# EasyEDA Pro project 单相电表PCB.epro

# Schematic Schematic1
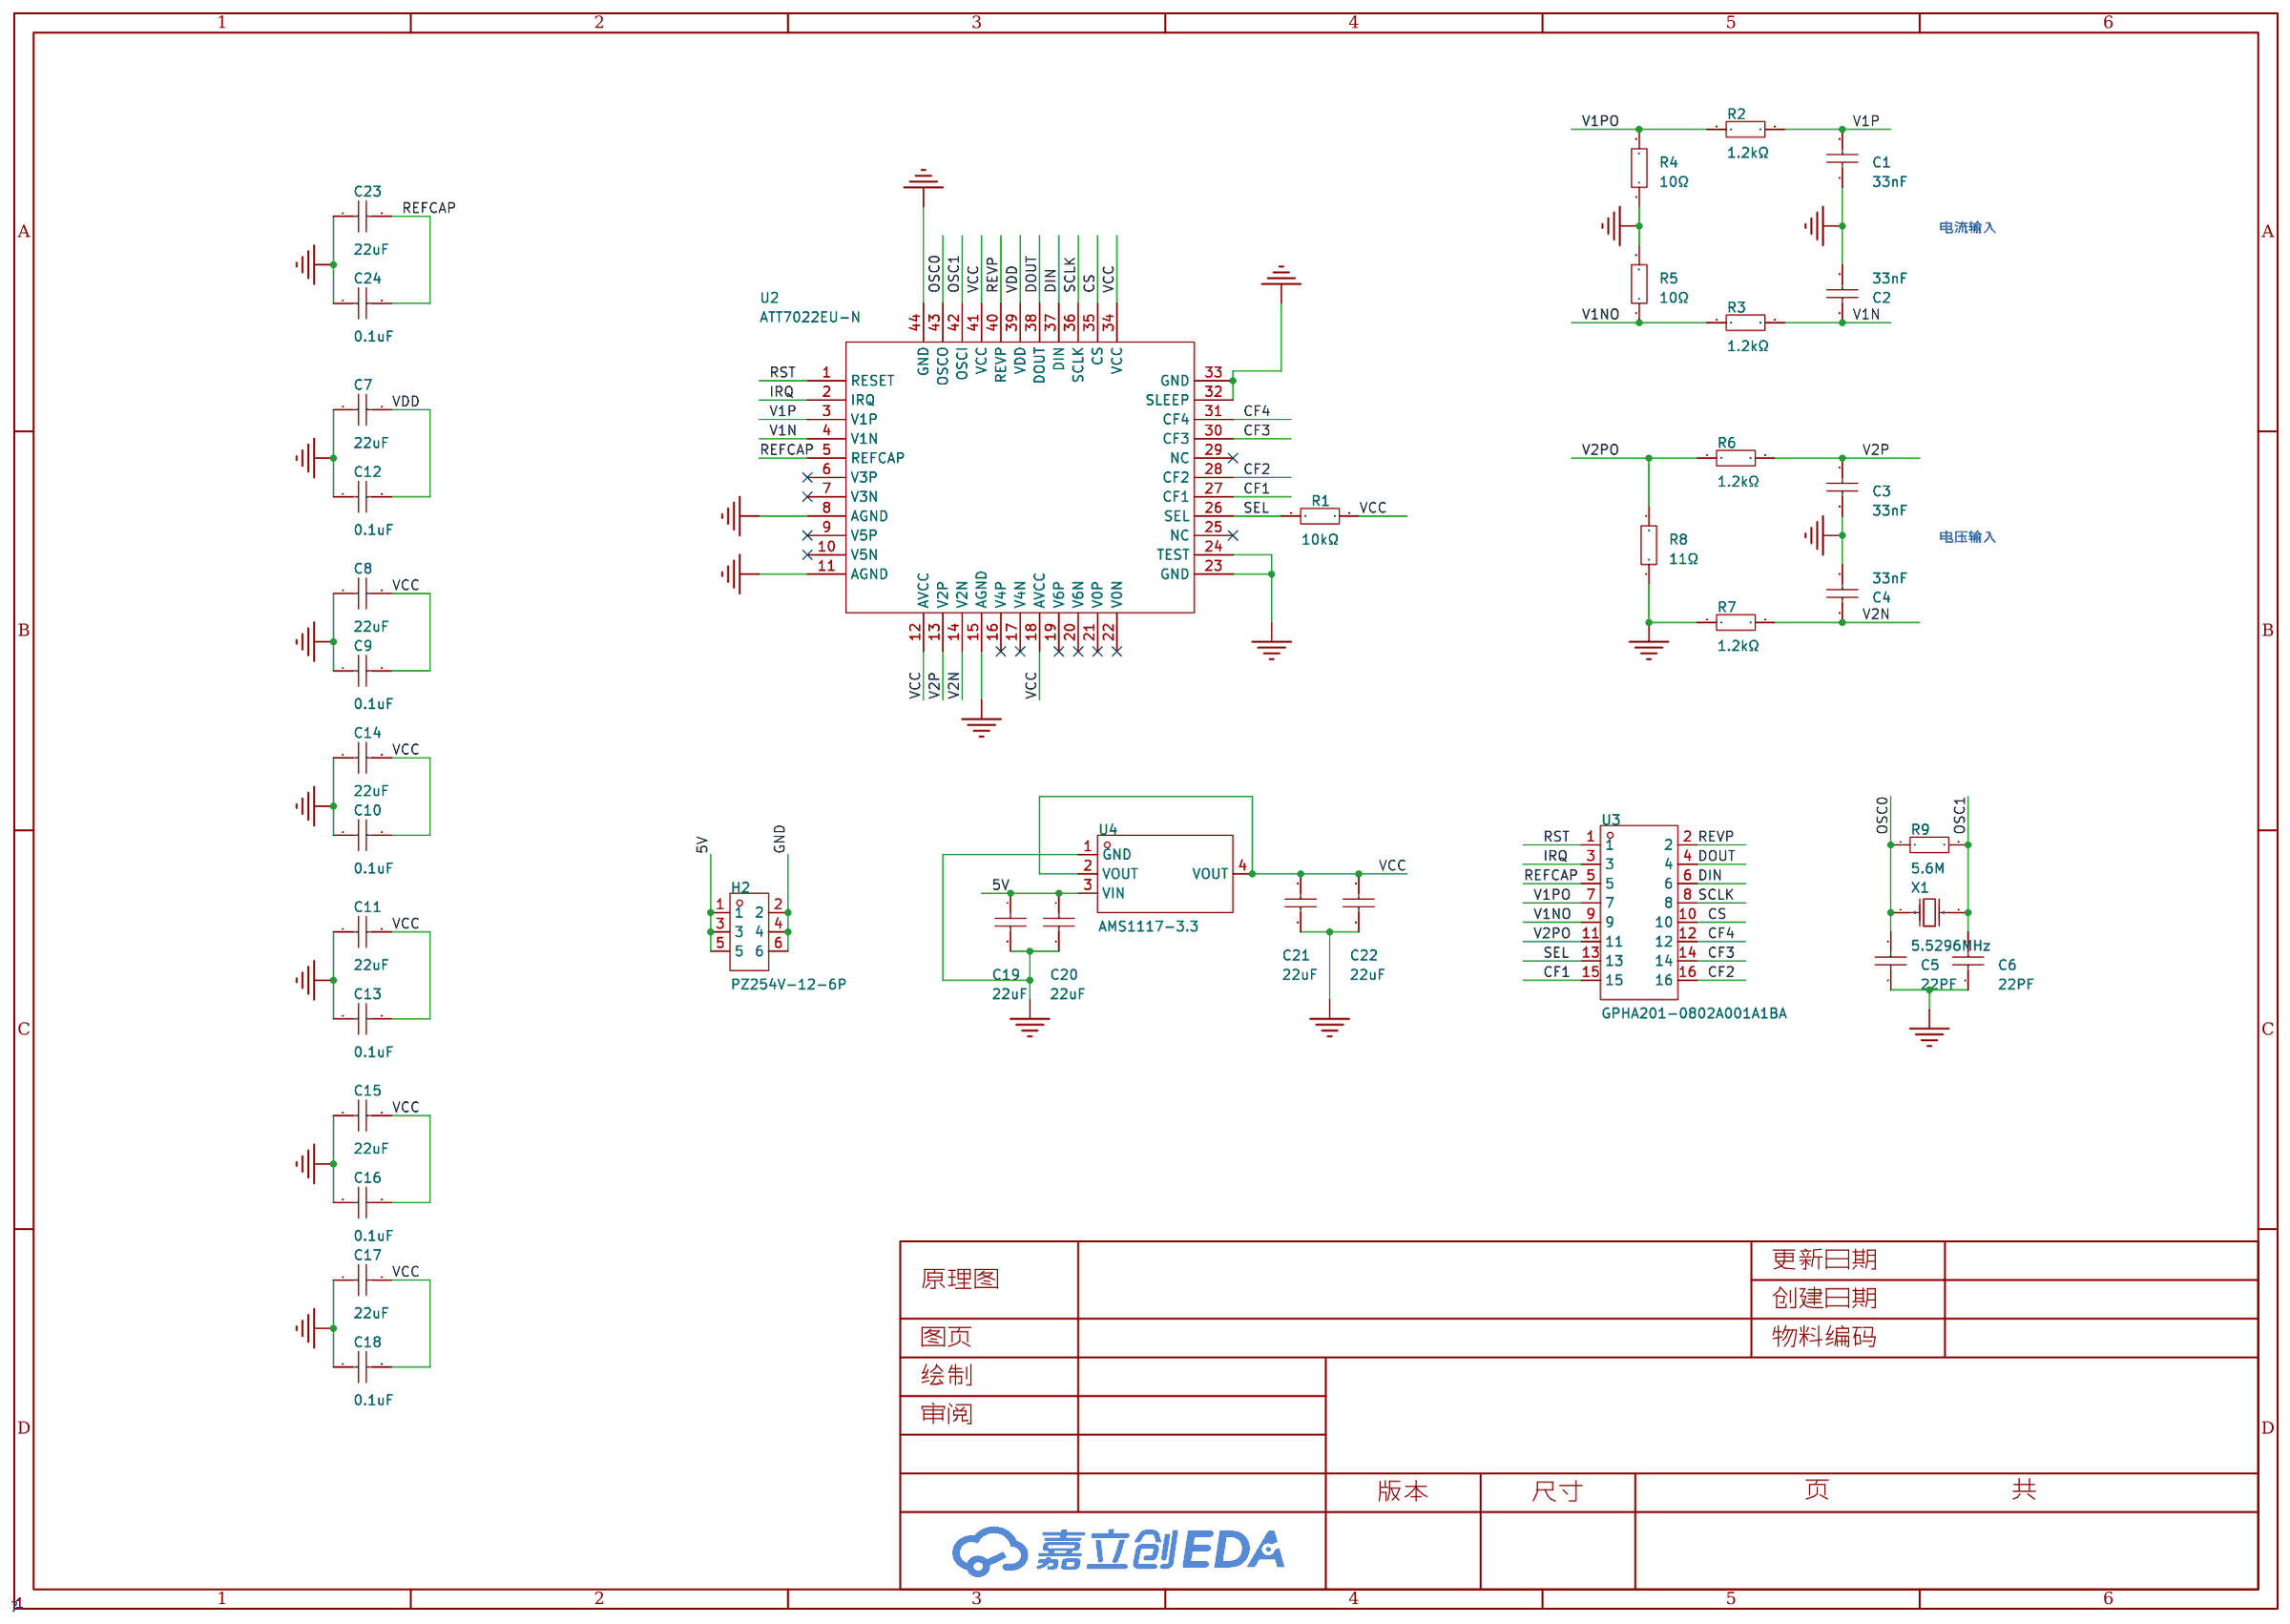
[diagram p0: schematic sheet]

## Parts
C1  33nF  [C0805]
C2  33nF  [C0805]
C3  33nF  [C0805]
C4  33nF  [C0805]
C5  22PF  [C0805]
C6  22PF  [C0805]
C7  22uF  [C0805]
C8  22uF  [C0805]
C9  0.1uF  [C0805]
C10  0.1uF  [C0805]
C11  22uF  [C0805]
C12  0.1uF  [C0805]
C13  0.1uF  [C0805]
C14  22uF  [C0805]
C15  22uF  [C0805]
C16  0.1uF  [C0805]
C17  22uF  [C0805]
C18  0.1uF  [C0805]
C19  22uF  [C0805]
C20  22uF  [C0805]
C21  22uF  [C0805]
C22  22uF  [C0805]
C23  22uF  [C0805]
C24  0.1uF  [C0805]
H2  PZ254V-12-6P  [HDR-TH_6P-P2.54-V-M-R2-C3-S2.54]
R1  10kΩ  [R0805]
R2  1.2kΩ  [R0805]
R3  1.2kΩ  [R0805]
R4  10Ω  [R0805]
R5  10Ω  [R0805]
R6  1.2kΩ  [R0805]
R7  1.2kΩ  [R0805]
R8  11Ω  [R0805]
R9  5.6M  [R0805]
U2  ATT7022EU-N  [LQFP-44_L10.0-W10.0-P0.80-LS12.0-BL]
U3  GPHA201-0802A001A1BA  [HDR-TH_16P-P2.54-V-M-R2-C8-S2.54]
U4  AMS1117-3.3  [SOT-223-3_L6.5-W3.4-P2.30-LS7.0-BR]
X1  5.5296MHz  [HC-49S_L11.4-W4.8-LS12.7]

## Library data of the parts
C1-C24 = CC0805KRX7R9BB104: 容值:100nF;精度:±10%;额定电压:50V;材质(温度系数):X7R;; LCSC Part Name: 100nF ±10% 50V; Supplier Part: C49678; Manufacturer: YAGEO(国巨); Supplier Footprint: 0805; JLCPCB Part Class: 基础库; Datasheet: https://atta.szlcsc.com/upload/public/pdf/source/20180224/C181747_15194369449651363981.pdf; Supplier: LCSC; Tolerance: ±10%; Voltage Rated: 50V; Temperature Coefficient: X7R
H2 = PZ254V-12-6P: 插针结构:2x3P;间距:2.54mm;行距:2.54mm;圆针/方针:方针;安装类型:直插;排数:双排;总PIN位数:6P;额定电流:-;额定电压:-;配合针长度:6mm;塑高:2.5mm;端接针长度:3mm;触头材质:黄铜;触头镀层:-;工作温度范围:-40℃~+105℃;颜色:黑色;; LCSC Part Name: 间距:2.54mm 2x3P 直插 方针; Supplier Part: C492420; Manufacturer: XFCN(兴飞); Supplier Footprint: 插件,P=2.54mm; JLCPCB Part Class: 扩展库; Datasheet: https://atta.szlcsc.com/upload/public/pdf/source/20200309/C492420_BAECB307B001054C09D200388220EAE6.pdf; Supplier: LCSC; Pin Structure: 2x3P; Pitch: 2.54mm; Row Spacing: 2.54mm; Circluar Pins/Square Pins: 方针; Mounting Type: 直插; Number of Rows: 双排; Number of Pins: 6P; Length of Mating Pin: 6mm; Insulation Height: 2.5mm; Length of End Connection Pin: 3mm; Contact Material: 黄铜; Operating Temperature Range: -40℃~+105℃; Color: 黑色
R1-R9 = 0805W8F1002T5E_C17414: 电阻类型:厚膜电阻;阻值:10kΩ;精度:±1%;功率:125mW;最大工作电压:150V;温度系数:±100ppm/℃;; LCSC Part Name: 10kΩ ±1% 125mW 厚膜电阻; Supplier Part: C17414; Manufacturer: UNI-ROYAL(厚声); Manufacturer Part: 0805W8F1002T5E; Supplier Footprint: 0805; JLCPCB Part Class: 基础库; Datasheet: https://atta.szlcsc.com/upload/public/pdf/source/20200306/C422600_1E6D84923E4A46A82E41ADD87F860B5C.pdf; Supplier: LCSC; Type: 厚膜电阻; Tolerance: ±1%; Power(Watts): 125mW; Overload Voltage (Max): 150V; Temperature Coefficient: ±100ppm/℃; Operating Temperature Range: -55℃~+155℃
U2 = ATT7022EU-N: Supplier Part: C81610; Manufacturer: 钜泉光电; Supplier Footprint: LQFP-44(10x10); JLCPCB Part Class: 扩展库; Datasheet: https://atta.szlcsc.com/upload/public/pdf/source/20170821/C126777_1503303399836901652.pdf; Supplier: LCSC
U3 = GPHA201-0802A001A1BA: 插针结构:2x8P;间距:2.54mm;行距:2.54mm;圆针/方针:方针;安装类型:直插;排数:双排;总PIN位数:16P;额定电流:3A;工作温度范围:-40℃~+105℃;; LCSC Part Name: 2x8P 间距:2.54mm 方针 直插; Supplier Part: C7434500; Manufacturer: GREENCONN(格康); Supplier Footprint: 插件,P=2.54mm; JLCPCB Part Class: 扩展库; Datasheet: https://atta.szlcsc.com/upload/public/pdf/source/20230629/613DF7C618537BFD465DA32CACFAE383.pdf; Supplier: LCSC; Pin Structure: 2x8P; Pitch: 2.54mm; Row Spacing: 2.54mm; Circluar Pins/Square Pins: 方针; Mounting Type: 直插; Number of Rows: 双排; Number of Pins: 16P; Current Rating (Max): 3A; Operating Temperature Range: -40℃~+105℃
U4 = AMS1117-3.3_C6186: 输出类型:固定;最大输入电压:-;输出电压:3.3V;最大输出电流:1A;电源纹波抑制比(PSRR):72dB@(120Hz);输出极性:正极;; LCSC Part Name: 输出3.3V 1A; Supplier Part: C6186; Manufacturer: AMS; Supplier Footprint: SOT-223; JLCPCB Part Class: 基础库; Datasheet: https://atta.szlcsc.com/upload/public/pdf/source/20180727/C6186_7A095716F0823C02F1997A905E26C086.pdf; Supplier: LCSC; Output Type: 固定; Output Voltage: 3.3V; MAX Output Current: 1A; Power Supply Rejection Ratio (PSRR): 72dB@(120Hz); Dropout Voltage: 1.3V@(800mA); Output Polarity: 正极; Number of Outputs: 1
X1 = H6OEL89CSC-SUGYLC-5.5296M: 晶振类型:贴片晶振;频率:5.5296MHz;常温频差:±20ppm;外接负载电容:20pF;频率稳定度(全温):±30ppm;; LCSC Part Name: 5.5296MHz ±20ppm 20pF; Supplier Part: C7471630; Manufacturer: YXC(扬兴晶振); Supplier Footprint: HC-49S-SMD; Datasheet: https://atta.szlcsc.com/upload/public/pdf/source/20240329/3EBF42EBCAB50CA65B6FA9D7CFA1955A.pdf; Supplier: LCSC; Crystal Type: 贴片晶振; Normal temperature Frequency Tolerance: ±20ppm; External load capacitor: 20pF; Frequency Stability(Full temperature range): ±30ppm; Operating Temperature: -20℃~+70℃

## Nets
5V: C19.1 C20.1 H2.1 H2.3 H2.5 U4.3(VIN)
GND: C1.1 C2.2 C3.1 C4.2 C5.1 C6.1 C7.2 C8.2 C9.2 C10.2 C11.2 C12.2 C13.2 C14.2 C15.2 C16.2 C17.2 C18.2 C19.2 C20.2 C21.2 C22.2 C23.2 C24.2 H2.2 H2.4 H2.6 R4.1 R5.2 R7.1 R8.1 U2.8(AGND) U2.11(AGND) U2.15(AGND) U2.23(GND) U2.24(TEST) U2.32(SLEEP) U2.33(GND) U2.44(GND) U4.1(GND)
V1N: C2.1 R3.2 U2.4(V1N)
V1NO: R3.1 R5.1 U3.9
V1P: C1.2 R2.2 U2.3(V1P)
V1PO: R2.1 R4.2 U3.7
V2N: C4.1 R7.2 U2.14(V2N)
V2P: C3.2 R6.2 U2.13(V2P)
V2PO: R6.1 R8.2 U3.11
VCC: C8.1 C9.1 C10.1 C11.1 C13.1 C14.1 C15.1 C16.1 C17.1 C18.1 C21.1 C22.1 R1.2 U2.12(AVCC) U2.18(AVCC) U2.34(VCC) U2.41(VCC) U4.2(VOUT) U4.4(VOUT)
VDD: C7.1 C12.1 U2.39(VDD)
CF1: U2.27(CF1) U3.15
CF2: U2.28(CF2) U3.16
CF3: U2.30(CF3) U3.14
CF4: U2.31(CF4) U3.12
CS: U2.35(CS) U3.10
DIN: U2.37(DIN) U3.6
DOUT: U2.38(DOUT) U3.4
IRQ: U2.2(IRQ) U3.3
OSC0: C5.2 R9.1 U2.43(OSCO) X1.1(OSC1)
OSC1: C6.2 R9.2 U2.42(OSCI) X1.2(OSC2)
REFCAP: C23.1 C24.1 U2.5(REFCAP) U3.5
REVP: U2.40(REVP) U3.2
RST: U2.1(RESET) U3.1
SCLK: U2.36(SCLK) U3.8
SEL: R1.1 U2.26(SEL) U3.13

Not connected (* = marked no-connect by the designer): U2 6(V3P)* 7(V3N)* 9(V5P)* 10(V5N)* 16(V4P)* 17(V4N)* 19(V6P)* 20(V6N)* 21(V0P)* 22(V0N)* 25(NC)* 29(NC)*

## Notes on the sheet
- 电流输入
- 电压输入

# Board PCB1
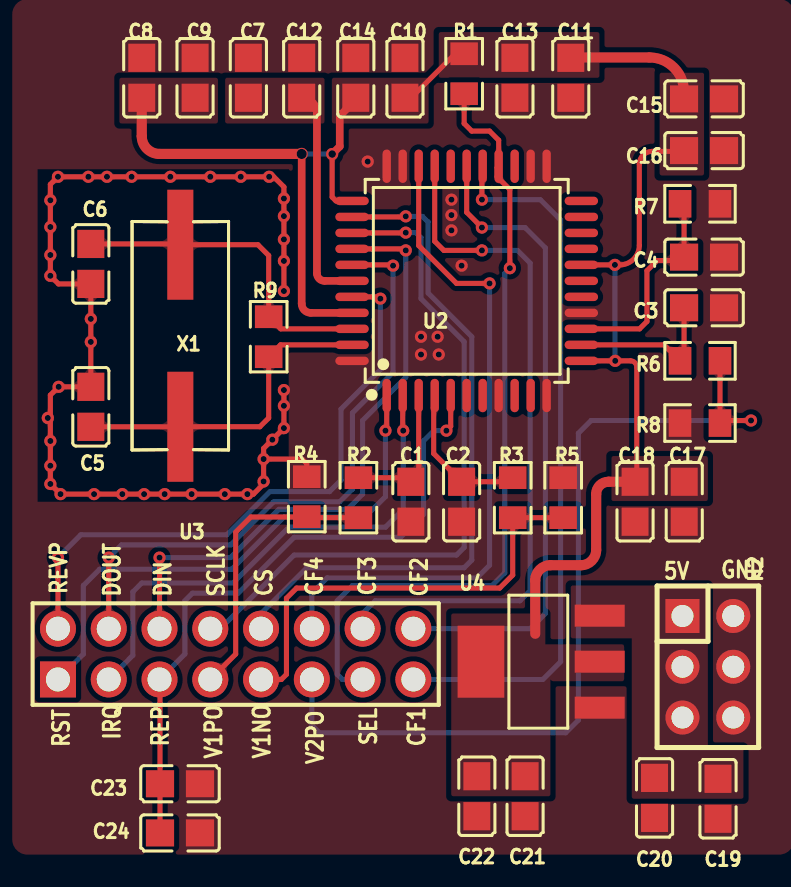
[diagram p1: board, top side]
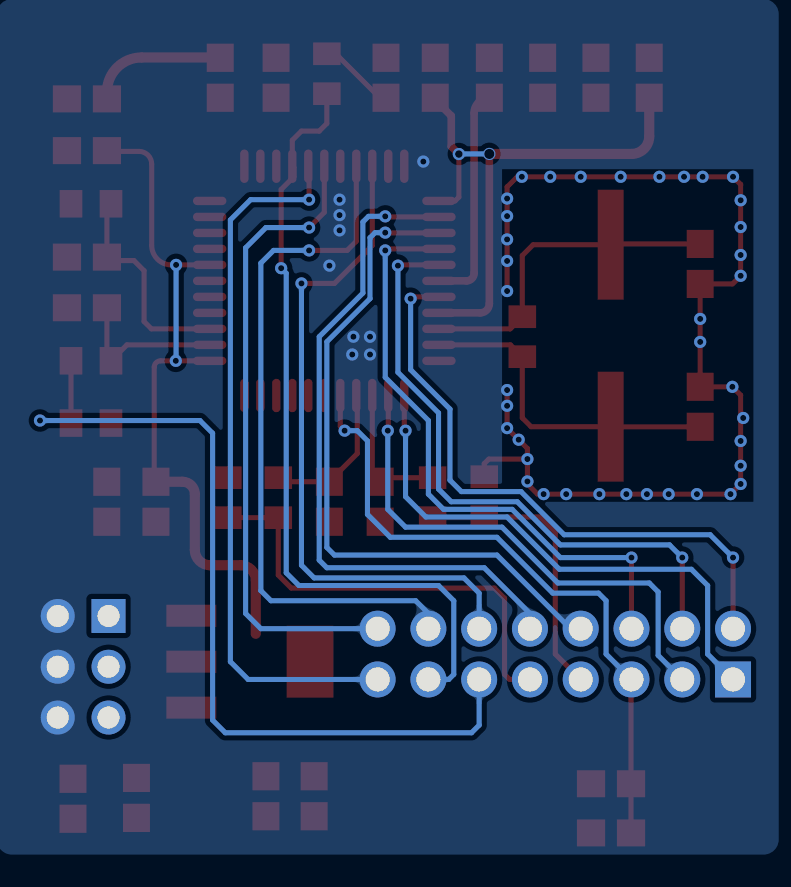
[diagram p2: board, bottom side, seen from below]

No outline. copper layers: Top Layer, Bottom Layer. Coordinates in mm from the lowest, leftmost part position.
Stack: Top Layer 0.035mm / Dielectric1 1.51mm FR4 er 4.5 / Bottom Layer 0.035mm

## Design rules (mm)
template: 自定义配置
spacing copperThickness1oz (default): track to track 0.102, other pairs 0.152 to 0.3
spacing copperThickness2oz: track to track 0.203, other pairs 0.152 to 0.3
track width copperThickness1oz (default): min 0.127, default 0.254, max 2.54
track width copperThickness2oz: min 0.203, default 0.254, max 2.54
differential pair differentialPair (default): width min 0.127, default 0.254, max 2.54; gap min 0.152, default 0.152
via viaSize (default): diameter min 0.5, default 0.61, max 10; hole min 0.3, default 0.305, max 6.3

## Placement (name value [footprint] x y rotation side)
C1  33nF  [C0805]  16.01 16.57 90 top
C2  33nF  [C0805]  18.55 16.57 270 top
C3  33nF  [C0805]  30.68 26.27 180 top
C4  33nF  [C0805]  30.68 28.81 0 top
C5  22PF  [C0805]  0 21.32 270 top
C6  22PF  [C0805]  0 28.46 90 top
C7  22uF  [C0805]  7.88 37.78 90 top
C8  22uF  [C0805]  2.55 37.78 90 top
C9  0.1uF  [C0805]  5.21 37.78 90 top
C10  0.1uF  [C0805]  15.72 37.78 90 top
C11  22uF  [C0805]  24.01 37.78 270 top
C12  0.1uF  [C0805]  10.55 37.78 90 top
C13  0.1uF  [C0805]  21.22 37.78 270 top
C14  22uF  [C0805]  13.26 37.78 90 top
C15  22uF  [C0805]  30.68 36.72 0 top
C16  0.1uF  [C0805]  30.68 34.13 0 top
C17  22uF  [C0805]  29.69 16.57 270 top
C18  0.1uF  [C0805]  27.23 16.57 270 top
C19  22uF  [C0805]  31.38 1.71 270 top
C20  22uF  [C0805]  28.2 1.75 270 top
C21  22uF  [C0805]  21.72 1.84 270 top
C22  22uF  [C0805]  19.31 1.84 270 top
C23  22uF  [C0805]  4.46 2.46 0 top
C24  0.1uF  [C0805]  4.46 0 0 top
H2  PZ254V-12-6P  [HDR-TH_6P-P2.54-V-M-R2-C3-S2.54]  30.87 8.31 270 top
R1  10kΩ  [R0805]  18.68 37.98 90 top
R2  1.2kΩ  [R0805]  13.39 16.77 90 top
R3  1.2kΩ  [R0805]  21.11 16.77 90 top
R4  10Ω  [R0805]  10.8 16.82 270 top
R5  10Ω  [R0805]  23.63 16.77 90 top
R6  1.2kΩ  [R0805]  30.48 23.62 180 top
R7  1.2kΩ  [R0805]  30.48 31.47 180 top
R8  11Ω  [R0805]  30.48 20.5 0 top
R9  5.6M  [R0805]  8.9 24.82 90 top
U2  ATT7022EU-N  [LQFP-44_L10.0-W10.0-P0.80-LS12.0-BL]  18.8 27.62 0 top
U3  GPHA201-0802A001A1BA  [HDR-TH_16P-P2.54-V-M-R2-C8-S2.54]  7.25 8.95 0 top
U4  AMS1117-3.3  [SOT-223-3_L6.5-W3.4-P2.30-LS7.0-BR]  22.49 8.57 0 top
X1  5.5296MHz  [HC-49S_L11.4-W4.8-LS12.7]  4.48 24.87 90 top

## Footprints (pads in the part's own frame, mm; a bottom-side part is the same pattern mirrored in y, then rotated)
C0805
  rect 1.41x1.35 smd: 1(-1,0) 2(1,0)
HC-49S_L11.4-W4.8-LS12.7
  rect 5.5x1.3 smd: 1(-4.553,0) 2(4.553,0)
HDR-TH_6P-P2.54-V-M-R2-C3-S2.54
  rect 1.7x1.7 hole 1.1: 1(-2.54,-1.27)
  round 1.7 hole 1.1: 2(-2.54,1.27) 3(0,-1.27) 4(0,1.27) 5(2.54,-1.27) 6(2.54,1.27)
HDR-TH_16P-P2.54-V-M-R2-C8-S2.54
  rect 1.8x1.8 hole 1.2: 1(-8.89,-1.27)
  round 1.8 hole 1.2: 2(-8.89,1.27) 3(-6.35,-1.27) 4(-6.35,1.27) 5(-3.81,-1.27) 6(-3.81,1.27) 7(-1.27,-1.27) 8(-1.27,1.27) 9(1.27,-1.27) 10(1.27,1.27) 11(3.81,-1.27) 12(3.81,1.27) 13(6.35,-1.27) 14(6.35,1.27) 15(8.89,-1.27) 16(8.89,1.27)
LQFP-44_L10.0-W10.0-P0.80-LS12.0-BL
  oval 0.42x1.67 smd: 1(-4,-5.735) 2(-3.2,-5.735) 3(-2.4,-5.735) 4(-1.6,-5.735) 5(-0.8,-5.735) 6(0,-5.735) 7(0.8,-5.735) 8(1.6,-5.735) 9(2.4,-5.735) 10(3.2,-5.735) 11(4,-5.735) 23(4,5.735) 24(3.2,5.735) 25(2.4,5.735) 26(1.6,5.735) 27(0.8,5.735) 28(0,5.735) 29(-0.8,5.735) 30(-1.6,5.735) 31(-2.4,5.735) 32(-3.2,5.735) 33(-4,5.735)
  oval 1.67x0.42 smd: 12(5.735,-4) 13(5.735,-3.2) 14(5.735,-2.4) 15(5.735,-1.6) 16(5.735,-0.8) 17(5.735,0) 18(5.735,0.8) 19(5.735,1.6) 20(5.735,2.4) 21(5.735,3.2) 22(5.735,4) 34(-5.735,4) 35(-5.735,3.2) 36(-5.735,2.4) 37(-5.735,1.6) 38(-5.735,0.8) 39(-5.735,0) 40(-5.735,-0.8) 41(-5.735,-1.6) 42(-5.735,-2.4) 43(-5.735,-3.2) 44(-5.735,-4)
R0805
  rect 1.133x1.377 smd: 1(-1,0) 2(1,0)
SOT-223-3_L6.5-W3.4-P2.30-LS7.0-BR
  rect 2.5x1.1 smd: 1(2.97,-2.3) 2(2.97,0) 3(2.97,2.3)
  rect 2.34x3.6 smd: 4(-2.97,0)

## Nets
As in the schematic.

Pads without a net: U2 6 7 9 10 16 17 19 20 21 22 25 29

## Via types
v1: diameter 0.61, hole 0.305, Top Layer to Bottom Layer, 66 vias
v2: diameter 0.61, hole 0.508, Top Layer to Bottom Layer, 1 via
v3: diameter 0.61, hole 0.381, Top Layer to Bottom Layer, 1 via

## Routing (per net, layer and track width the routed paths; a pad name or vN(x,y) marks a point on that pad's centre or on a via; arc(x,y) is an arc through that point)
GND: length 55
  Top Layer w0.254: v1(9.66,27.11) v1(9.66,28.61) v1(9.66,29.69) v1(9.66,30.86) v1(9.66,31.74) 9.66,32.32 9.15,32.82 v1(7.5,32.82) v1(5.98,32.82) v1(3.98,32.82) v1(2.04,32.82) v1(0.81,32.82) v1(-0.12,32.82) v1(-1.64,32.82) -2.02,32.44 v1(-2.02,31.65) v1(-2.02,30.31) v1(-2.02,28.91) v1(-2.02,27.87) -1.62,27.46 C6.1 v1(0,25.71) v1(0,24.56) C5.1 v1(-1.61,22.32) -2.02,21.9 v1(-2.02,19.61) v1(-2.02,18.37) v1(-2.02,17.46) v1(-1.52,16.95) v1(0.16,16.95) v1(1.58,16.95) v1(2.67,16.95) v1(3.69,16.95) v1(5.04,16.95) v1(6.7,16.95) 8.14,16.95 8.64,17.46 v1(8.64,17.58) v1(8.64,18.7) ; 10.8,17.77 10.8,18.47 10.57,18.7 v1(8.64,18.7) ; v1(8.64,18.7) 8.64,19.23 v1(9.08,19.67) v1(9.66,20.25) v1(9.66,21.37) v1(9.66,22.16)
  vias: v1(-2.15,20.76) v1(7.83,16.95) v1(8.92,32.82) v1(13.85,33.59) v1(16.52,24.82) v1(16.52,23.93) v1(17.35,24.82) v1(17.41,23.93) v1(18.04,31.68) v1(18.04,30.91) v1(18.04,30.14) v1(18.55,28.38)
V1N: length 7.6
  Top Layer w0.254: U2.4 17.15,21.83 17.15,18.98 18.55,17.58 C2.1 20.9,17.57 R3.2
V1NO: length 22.4
  Top Layer w0.254: U3.9 9.53,7.68 9.79,7.93 9.79,11.74 10.29,12.25 20.45,12.25 21.11,12.9 R3.1 R5.1
V1P: length 7.2
  Top Layer w0.254: R2.2 15.81,17.77 C1.2 16.4,17.96 U2.3
V1PO: length 14.7
  Top Layer w0.254: 11.1,15.77 R2.1 ; 11.1,15.77 11.06,15.81 8.01,15.81 7.25,15.04 7.25,8.95 5.98,7.68 ; 11.1,15.77 10.8,15.77
V2N: length 10.9
  Top Layer w0.254: 24.54,25.22 27.45,25.22 27.82,25.58 27.82,28.12 28.33,28.63 29.5,28.63 C4.1 29.68,31.27 R7.2
V2P: length 8
  Top Layer w0.254: 24.54,24.42 28.68,24.42 R6.2 29.68,23.82 C3.2
V2PO: length 44
  Top Layer w0.254: R6.1 R8.2 31.6,20.63 v1(33.03,20.63)
  Bottom Layer w0.254: U3.11 11.06,5.39 11.44,5.01 23.76,5.01 24.39,5.65 24.39,20 25.03,20.63 v1(33.03,20.63)
VCC: length 75
  Top Layer w0.254: C10.1 16.03,36.78 18.23,38.98 R1.2 ; v3(12.07,33.96) 12.07,31.81 12.26,31.62 U2.34 ; C18.1 27.28,17.62 arc(27.3,17.63) 27.31,17.65 27.31,23.3 arc(27.22,23.52) 26.99,23.62 v1(26.23,23.62) 24.54,23.62 ; 24.54,28.42 26.46,28.42 arc(27.15,28.7) 27.44,29.39 27.44,33.46 arc(27.63,33.91) 28.07,34.09 29.64,34.09 arc(29.67,34.11) C16.1
  Top Layer w0.381: U2.41 11.01,26.02 arc(10.68,26.15) 10.55,26.47 v2(10.55,33.97) ; C14.1 13.26,36.67 12.45,35.87 12.45,34.34 v3(12.07,33.96)
  Top Layer w0.508: 22.23,9.96 22.23,12.63 arc(22.46,13.17) 22.99,13.39 24.52,13.39 arc(25.06,13.62) 25.28,14.15 25.28,16.95 arc(25.46,17.39) 25.9,17.57 C18.1 ; C15.1 29.68,37.06 arc(29.17,38.29) 27.95,38.79 24.03,38.79 arc(24.02,38.79) C11.1 ; C8.1 2.55,34.86 arc(2.81,34.23) 3.44,33.97 v2(10.55,33.97)
  Bottom Layer w0.254: v1(26.23,23.62) 26.22,23.63 v1(26.22,28.42) ; v3(12.07,33.96) 12.07,33.97 v2(10.55,33.97)
VDD: length 11.2
  Top Layer w0.381: U2.39 11.69,27.62 arc(11.42,27.73) 11.31,28 11.31,36.01 arc(11.09,36.55) C12.1
CF1: length 35.9
  Top Layer w0.254: U2.27 19.57,33.31 v1(19.57,31.68)
  Bottom Layer w0.254: v1(19.57,31.68) 22.49,31.68 23.5,30.66 23.5,8.57 22.61,7.68 U3.15
CF2: length 32.2
  Top Layer w0.254: v1(19.57,30.28) 18.8,31.05 U2.28
  Bottom Layer w0.254: v1(19.57,30.28) 21.72,30.28 22.74,29.27 22.74,10.98 21.98,10.22 U3.16
CF3: length 35
  Top Layer w0.254: v1(19.57,29.14) 17.66,29.14 17.2,29.6 U2.30
  Bottom Layer w0.254: v1(19.57,29.14) 21.34,29.14 21.98,28.51 21.98,12.12 21.47,11.61 14.23,11.61 13.6,10.98 13.6,10.22
CF4: length 33.6
  Top Layer w0.254: v1(19.95,27.49) 18.3,27.49 16.4,29.38 U2.31
  Bottom Layer w0.254: U3.12 11.06,12 11.82,12.76 19.31,12.76 19.95,13.39 v1(19.95,27.49)
CS: length 34.2
  Top Layer w0.254: v1(15.76,30.84) 15.73,30.82 U2.35
  Bottom Layer w0.254: U3.10 8.52,10.98 10.8,13.27 18.68,13.27 19.06,13.65 19.06,24.82 16.87,27.01 16.87,30.56 16.59,30.84 v1(15.76,30.84)
DIN: length 30.8
  Top Layer w0.254: v1(15.76,29.14) 15.68,29.22 13.07,29.22 ; v1(3.44,13.77) U3.6
  Bottom Layer w0.254: v1(3.44,13.77) 6.99,13.77 9.41,16.19 12.83,16.19 13.6,16.95 13.6,20.63 15.76,22.79 v1(15.76,29.14)
DOUT: length 31.3
  Top Layer w0.254: v1(15.12,28.38) 15.08,28.42 U2.38 ; v1(0.9,13.77) U3.4
  Bottom Layer w0.254: v1(15.12,28.38) 15.12,23.04 13.09,21.01 13.09,17.2 12.45,16.57 9.15,16.57 6.99,14.41 1.53,14.41 v1(0.9,13.77)
IRQ: length 25.8
  Top Layer w0.254: U2.2 15.6,20.15 v1(15.63,20.12)
  Bottom Layer w0.254: v1(15.63,20.12) 15.63,16.19 14.74,15.3 9.91,15.3 7.12,12.5 2.55,12.5 2.1,12.06 2.1,8.88 U3.3
OSC0: length 16.6
  Top Layer w0.254: U2.43 9.49,24.42 R9.1 8.9,20.76 8.46,20.32 X1.1 4.47,20.32 C5.2
OSC1: length 16.6
  Top Layer w0.254: C6.2 4.44,29.46 X1.2 8.36,29.42 8.9,28.89 R9.2 9.5,25.22 U2.42
REFCAP: length 32.8
  Top Layer w0.254: v1(17.79,20.12) 18,20.34 U2.5 ; U3.5 3.46,7.65 C23.1 C24.1
  Bottom Layer w0.254: U3.5 4.71,8.95 4.71,11.61 5.09,12 7.37,12 10.17,14.79 15.5,14.79 16.64,15.93 16.64,19.62 17.15,20.12 v1(17.79,20.12)
REVP: length 30.7
  Top Layer w0.254: U2.40 14.4,26.82 v1(14.49,26.73) ; v1(-1.64,13.77) -1.64,10.22
  Bottom Layer w0.254: v1(14.49,26.73) 14.49,23.17 12.52,21.2 12.52,17.65 11.95,17.08 8.96,17.08 6.8,14.92 -0.5,14.92 v1(-1.64,13.77)
RST: length 27.3
  Top Layer w0.254: U2.1 14.8,20.19 v1(14.74,20.12)
  Bottom Layer w0.254: -1.64,7.68 -0.37,8.95 -0.37,12.38 0.44,13.19 7.04,13.19 9.66,15.81 13.72,15.81 14.74,16.82 v1(14.74,20.12)
SCLK: length 34.3
  Top Layer w0.254: v1(15.76,30.03) 15.74,30.02 U2.36
  Bottom Layer w0.254: v1(15.76,30.03) 16.26,30.03 16.52,29.78 16.52,26.73 18.68,24.57 18.68,14.28 18.3,13.9 10.17,13.9 6.48,10.22 5.98,10.22
SEL: length 39.6
  Top Layer w0.254: R1.1 18.68,35.49 19.06,35.11 19.95,35.11 20.4,34.65 U2.26 20.33,33.28 20.33,32.82 20.96,32.19 v1(20.96,28.25)
  Bottom Layer w0.254: v1(20.96,28.25) 20.71,28 20.71,13.01 20.07,12.38 13.09,12.38 12.33,11.61 12.33,7.93 12.58,7.68 13.6,7.68

## Copper pours and planes (outline as drawn; the poured copper is in the pictures)
5V on Top Layer: 24.01,12.38 30.87,12.38 30.87,4.27 32.62,4.27 32.65,4.25 32.65,1.71 27.06,1.71 27.06,9.74 24.01,9.74
GND on Top Layer: -3.93,40.95 -3.91,41.11 -3.86,41.27 -3.77,41.42 -3.64,41.55 -3.49,41.64 -3.32,41.7 -3.17,41.71 34.42,41.71 34.58,41.7 34.75,41.64 34.9,41.55 35.02,41.42 35.12,41.27 35.17,41.11 35.19,40.95 35.19,-0.32 35.17,-0.48 35.12,-0.65 35.02,-0.8 34.9,-0.92 34.75,-1.01 34.58,-1.07 34.42,-1.09 -3.17,-1.09 -3.32,-1.07 -3.49,-1.01 -3.64,-0.92 -3.77,-0.8 -3.86,-0.65 -3.91,-0.48 -3.93,-0.32
GND on Bottom Layer: -3.93,40.95 -3.91,41.11 -3.86,41.27 -3.77,41.42 -3.64,41.55 -3.49,41.64 -3.32,41.7 -3.17,41.71 34.42,41.71 34.58,41.7 34.75,41.64 34.9,41.55 35.02,41.42 35.12,41.27 35.17,41.11 35.19,40.95 35.19,-0.32 35.17,-0.48 35.12,-0.65 35.02,-0.8 34.9,-0.92 34.75,-1.01 34.58,-1.07 34.42,-1.09 -3.17,-1.09 -3.32,-1.07 -3.49,-1.01 -3.64,-0.92 -3.77,-0.8 -3.86,-0.65 -3.91,-0.48 -3.93,-0.32
VCC on Top Layer: 17.41,40.06 25.44,40.06 25.44,37.78 17.41,37.78
VCC on Top Layer: 28.46,38.03 30.68,38.03 30.68,32.89 28.46,32.89
VCC on Top Layer: 1.43,37.78 6.36,37.78 6.36,35.49 1.43,35.49
VCC on Top Layer: 12.06,37.78 16.9,37.78 16.9,35.49 12.06,35.49
VCC on Top Layer: 26.04,18.85 30.87,18.85 30.87,16.6 26.04,16.6 26.04,18.85
VCC on Top Layer: 22.74,10.98 22.74,9.43 26.68,9.43 26.68,7.59 23.08,7.59 22.99,7.68 22.99,1.84 18.03,1.84 18.03,10.98
VDD on Top Layer: 6.72,37.78 11.69,37.78 11.69,35.49 6.72,35.49

Small or netless copper shapes (teardrops, artwork), in the pictures only: 165 on Top Layer, 29 on Bottom Layer

## Text on the board
Top Silkscreen Layer: REVP | RST | DOUT | IRQ | REP | DIN | V1PO | SCLK | V1NO | CS | CF4 | V2PO | CF3 | SEL | CF1 | CF2 | 5V | GND
